# Altium schematic sheet Sheet1.SchDoc
size A4; SheetNumber: 1; SheetTotal: 1; SPICEModelCacheQXPVCDDZ: <root> / <DocumentId>QXPVCDDZ</DocumentId> / <CacheFrame Number="0"> / <Model Name="cap" Kind="MDL"> / <Text>*Default semiconductor capacitor / .MODEL CAP C()</Text> / </Model> / </CacheFrame> / </root>
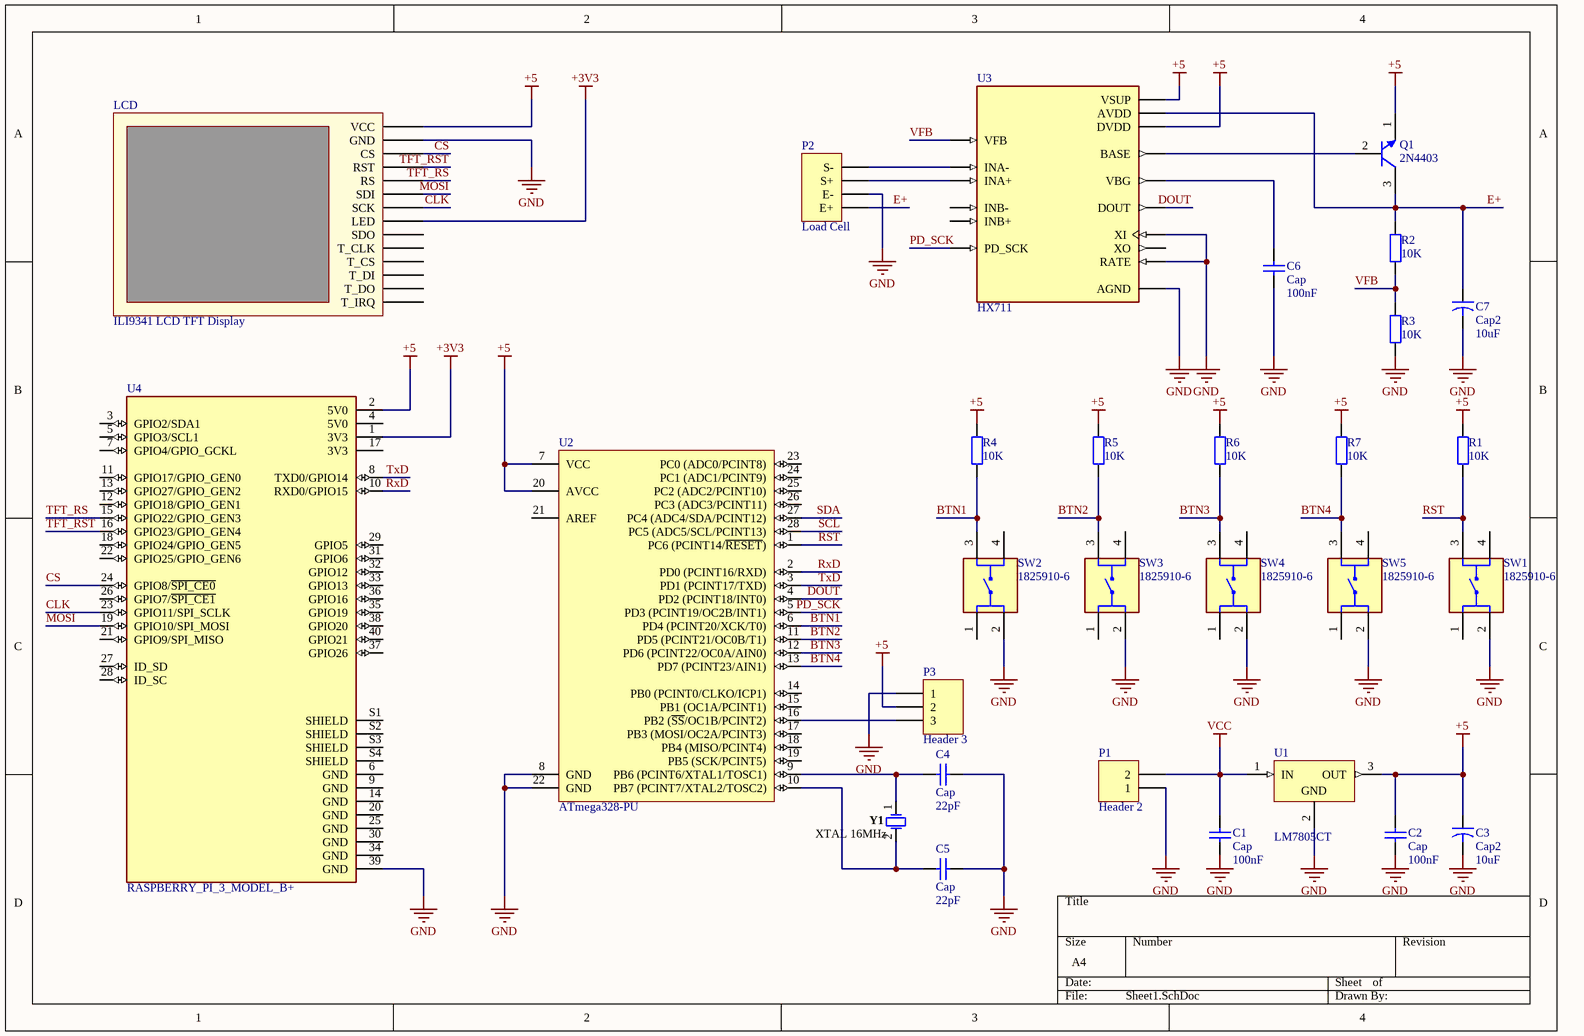
[diagram p0: Sheet1.SchDoc]

## Parts
C1  Cap  value 100nF  [RAD-0.2]
C2  Cap  value 100nF  [RAD-0.2]
C3  Cap2  value 10uF  [R38]
C4  Cap  value 22pF  [RAD-0.1]
C5  Cap  value 22pF  [RAD-0.1]
C6  Cap  value 100nF  [RAD-0.2]
C7  Cap2  value 10uF  [R38]
LCD  ILI9341 LCD TFT Display  [ILI9341]
P1  Header 2  [HDR1X2]
P2  Load Cell  [HDR1X4]
P3  Header 3  [HDR1X3]
Q1  2N4403  [ONSC-TO-92-3-29-11_AM_BL]
R1  value 10K  [AXIAL-0.4]
R2  value 10K  [AXIAL-0.4]
R3  value 10K  [AXIAL-0.4]
R4  value 10K  [AXIAL-0.4]
R5  value 10K  [AXIAL-0.4]
R6  value 10K  [AXIAL-0.4]
R7  value 10K  [AXIAL-0.4]
SW1  1825910-6  [SW_1825910-6-4]
SW2  1825910-6  [SW_1825910-6-4]
SW3  1825910-6  [SW_1825910-6-4]
SW4  1825910-6  [SW_1825910-6-4]
SW5  1825910-6  [SW_1825910-6-4]
U1  LM7805CT  [FAIR-TO-220-3]
U2  ATmega328-PU  [28P3]
U3  HX711  [SOP127P600X180-16N]
U4  RASPBERRY_PI_3_MODEL_B+  [MODULE_RASPBERRY_PI_3_MODEL_B+]
Y1  XTAL 16MHz  [FOX-FOXSLF-2_V]

## Nets
+3V3: LCD.7(LED) U4.1(3V3)
+5: C2.2 C3.1 LCD.0(VCC) P3.2 Q1.1(E) R1.2 R4.2 R5.2 R6.2 R7.2 U1.3(OUT) U2.7(VCC) U2.20(AVCC) U3.1(VSUP) U3.16(DVDD) U4.2(5V0)
GND: C1.1 C2.1 C3.2 C4.2 C5.2 C6.1 C7.2 LCD.1(GND) P1.1 P2.2(E-) P3.1 R3.1 SW1.2 SW2.2 SW3.2 SW4.2 SW5.2 U1.2(GND) U2.8(GND) U2.22(GND) U3.5(AGND) U3.14(XI) U3.15(RATE) U4.39(GND)
VCC: C1.2 P1.2 U1.1(IN)
BTN1: R4.1 SW2.3 U2.6(PD4_(PCINT20/XCK/T0))
BTN2: R5.1 SW3.3 U2.11(PD5_(PCINT21/OC0B/T1))
BTN3: R6.1 SW4.3 U2.12(PD6_(PCINT22/OC0A/AIN0))
BTN4: R7.1 SW5.3 U2.13(PD7_(PCINT23/AIN1))
CLK: LCD.6(SCK) U4.23(GPIO11/SPI_SCLK)
CS: LCD.2(CS) U4.24(GPIO8/~{SPI_CE0})
DOUT: U2.4(PD2_(PCINT18/INT0)) U3.12(DOUT)
E+: C7.1 P2.1(E+) Q1.3(C) R2.2 U3.3(AVDD)
MOSI: LCD.5(SDI) U4.19(GPIO10/SPI_MOSI)
PD_SCK: U2.5(PD3_(PCINT19/OC2B/INT1)) U3.11(PD_SCK)
RST: R1.1 SW1.3 U2.1(PC6_(PCINT14/~{RESET}))
RxD: U2.2(PD0_(PCINT16/RXD)) U4.10(RXD0/GPIO15)
SCL: U2.28(PC5_(ADC5/SCL/PCINT13))
SDA: U2.27(PC4_(ADC4/SDA/PCINT12))
TFT_RS: LCD.4(RS) U4.15(GPIO22/GPIO_GEN3)
TFT_RST: LCD.3(RST) U4.16(GPIO23/GPIO_GEN4)
TxD: U2.3(PD1_(PCINT17/TXD)) U4.8(TXD0/GPIO14)
VFB: R2.1 R3.2 U3.4(VFB)
NetC4_1: C4.1 U2.9(PB6_(PCINT6/XTAL1/TOSC1)) Y1.1
NetC5_1: C5.1 U2.10(PB7_(PCINT7/XTAL2/TOSC2)) Y1.2
NetC6_2: C6.2 U3.6(VBG)
NetP2_3: P2.3(S+) U3.8(INA+)
NetP2_4: P2.4(S-) U3.7(INA-)
NetP3_3: P3.3 U2.16(PB2_(~{SS}/OC1B/PCINT2))
NetQ1_2: Q1.2(B) U3.2(BASE)

Not connected (* = marked no-connect by the designer): LCD 8(SDO) 9(T_CLK) 10(T_CS) 11(T_DI) 12(T_DO) 13(T_IRQ); SW1 1 4; SW2 1 4; SW3 1 4; SW4 1 4; SW5 1 4; U2 14(PB0_(PCINT0/CLKO/ICP1)) 15(PB1_(OC1A/PCINT1)) 17(PB3_(MOSI/OC2A/PCINT3)) 18(PB4_(MISO/PCINT4)) 19(PB5_(SCK/PCINT5)) 21(AREF) 23(PC0_(ADC0/PCINT8)) 24(PC1_(ADC1/PCINT9)) 25(PC2_(ADC2/PCINT10)) 26(PC3_(ADC3/PCINT11)); U3 9(INB-) 10(INB+) 13(XO); U4 3(GPIO2/SDA1) 4(5V0) 5(GPIO3/SCL1) 6(GND) 7(GPIO4/GPIO_GCKL) 9(GND) 11(GPIO17/GPIO_GEN0) 12(GPIO18/GPIO_GEN1) 13(GPIO27/GPIO_GEN2) 14(GND) 17(3V3) 18(GPIO24/GPIO_GEN5) 20(GND) 21(GPIO9/SPI_MISO) 22(GPIO25/GPIO_GEN6) 25(GND) 26(GPIO7/~{SPI_CE1}) 27(ID_SD) 28(ID_SC) 29(GPIO5) 30(GND) 31(GPIO6) 32(GPIO12) 33(GPIO13) 34(GND) 35(GPIO19) 36(GPIO16) 37(GPIO26) 38(GPIO20) 40(GPIO21) S1(SHIELD) S2(SHIELD) S3(SHIELD) S4(SHIELD)

## Library data of the parts
C1 C2 C4-C6 = Cap: Capacitor; Published: 8-Jun-2000; LatestRevisionDate: 17-Jul-2002; LatestRevisionNote: Re-released for DXP Platform.; PackageReference: RAD-0.3; Publisher: Altium Limited; PackageDescription: Radial Cap, Thru-Hole; 2 Leads; 0.3 in Pin Spacing
C3 C7 = Cap2: Capacitor; Published: 23-Sep-2002; PackageReference: CAPR5-4X5; Publisher: Altium Limited; PackageDescription: Capacitor; 2 Leads
LCD = ILI9341
P1 = Header 2: Header, 2-Pin; LatestRevisionDate: 17-Jul-2002; LatestRevisionNote: Re-released for DXP Platform.; Publisher: Altium Limited
P2 = Header 4: Load Cell Connector, 4-Pin; LatestRevisionDate: 17-Jul-2002; LatestRevisionNote: Re-released for DXP Platform.; Publisher: Altium Limited
P3 = Header 3: Header, 3-Pin; LatestRevisionDate: 17-Jul-2002; LatestRevisionNote: Re-released for DXP Platform.; Publisher: Altium Limited
Q1 = CMP-1048-01491-1: General Purpose Transistor, NPN Silicon, 3-Pin TO-92, Pb-Free, Ammo Box; PartNumber: 2N4401RLRPG; Manufacturer: On Semiconductor; IC Continuous (A): 0.6; fT Min (MHz): 250; DatasheetVersion: Rev. 4; ComponentLink1URL: http://www.onsemi.com/; PackageDescription: 3-Pin Transistor Outline, Body 4.825 x 3.685 mm, Pitch 1.27 mm; ComponentLink2URL: http://www.onsemi.com/pub_link/Collateral/2N4401-D.PDF; Packing: Ammo Box; ComponentLink1Description: Manufacturer URL; ComponentLink3Description: Package Specification; PackageVersion: Rev. AM; Polarity: NPN; Mounting Technology: Through Hole; RoHS: TRUE; ComponentLink2Description: Datasheet; ComponentLink3URL: http://www.onsemi.com/pub_link/Collateral/MAC97-D.PDF; PackageReference: TO-92-3-29-11_AM_BL
R1-R7 = Res2: Resistor; Published: 8-Jun-2000; LatestRevisionDate: 17-Jul-2002; LatestRevisionNote: Re-released for DXP Platform.; PackageReference: AXIAL-0.4; Publisher: Altium Limited; PackageDescription: Axial Device, Thru-Hole; 2 Leads; 0.4 in Pin Spacing
SW1-SW5 = 1825910-6: Switch Tactile OFF (ON) SPST Round Button PC Pins 0.05A 24VDC 100000Cycles 1.57N Thru-Hole Loose; Package: None; MP: 1825910-6; Value: *; Price: None; Availability: Unavailable
U1 = CMP-2000-04938-1: Positive Voltage Regulator, 5 V, 1 A, -40 to 125 degC, 3-Pin TO-220, RoHS, Tube; Manufacturer: FairchildSemiconductor; Maximum Input Voltage: 35V; Maximum Quiescent Current: 8mA; Load Regulation: 100mV; Maximum Output Current: 2.2(Typ)A; Output Type: Fixed; Typical Dropout Voltage @ Current: 2@1AV; Rad Hard: No; Output Voltage: 5V; Accuracy: ±4%; Number of Outputs: 1; Category: LinearRegulator; Package Description: 3-Pin Through Hole Device, Body 10 x 4.5 mm, Pitch 2.54 mm; Packaging: Rail/Tube; Mounting: ThroughHole; Polarity: Positive; Manufacturer URL: https://www.fairchildsemi.com/; Line Regulation: 100mV; Datasheet Version: Aug-12; Datasheet URL: https://datasheet.ciiva.com/26904/lm7805ct-26904988.pdf; Package Reference: TO-220; Package URL: https://www.fairchildsemi.com/package-drawings/TO/TO220B03.pdf; Package: 3TO-220AB; Operating Temperature: -40to125degC; Type: Linear
U2 = CMP-0095-00015-2: 8-bit AVR Microcontroller, 32KB Flash, 1KB EEPROM, 2KB SRAM, 28-pin PDIP, Industrial Grade (-40°C to 85°C); ComponentLink3Description: ATmega48A/48PA/88A/88PA/168A/168PA/328/328P Summary; RevisionNote: DatasheetVersion updated. URLs added.; DatasheetVersion: revD, May-2011; ComponentLink1URL: http://www.atmel.com/; PackageVersion: revB, Sep-2001; PackageDescription: 28-lead (0.300"/7.62mm Wide) Plastic Dual Inline Package (PDIP); PackageReference: 28P3; ComponentLink1Description: Manufacturer URL; ComponentLink2Description: ATmega48A/48PA/88A/88PA/168A/168PA/328/328P Datasheet; ComponentLink3URL: http://www.atmel.com/dyn/resources/prod_documents/8271S.pdf; ComponentLink2URL: http://www.atmel.com/dyn/resources/prod_documents/8271.pdf
U4 = RASPBERRY_PI_3_MODEL_B+: BCM2835 Raspberry Pi Model B+ - ARM11, VideoCore MPU Embedded Evaluation Board; Price: None; MP: RASPBERRY_PI_3_MODEL_B+; Value: *; Availability: Unavailable; Package: None
Y1 = CMP-1749-00004-1: Resistance Weld Thru-Hole Crystal, 12 MHz, +/-30 ppm, -20 to 70 degC, 2-Pin THD, RoHS, Bulk; Elements: 1; Rds On Max: 115 mohm; Typical Rise Time: 90 ns; Max Power Dissipation: 2.5 W; Case\Package: TO-251-3; Input Capacitance: 350 pF; REACH SVHC: No SVHC; Length: 6.6 mm; ComponentLink1URL: http://www.foxonline.com/; PackageDescription: 2-Pin Through Hole Device, Body 11.35 x 4.65 mm, Pitch 4.88 mm; Radiation Hardening: No; Package Quantity: 70; Packaging: Rail/Tube; ComponentLink1Description: Manufacturer URL; Min Operating Temperature: -55 degC; Max Operating Temperature: 150 degC; RoHSCompliant: true; PackageReference: FOXSLF-2; DatasheetVersion: Mar-15; Pins: 3; Height: 6.1 mm; Mount: Through Hole; ComponentLink2URL: http://www.foxonline.com/pdfs/hc49slf.pdf; ComponentLink2Description: Datasheet; Width: 2.3 mm
U3 = HX711: Value: *; Availability: Unavailable; Price: None; MP: HX711; Package: None